# Altium project LPS_camp.PrjPcb
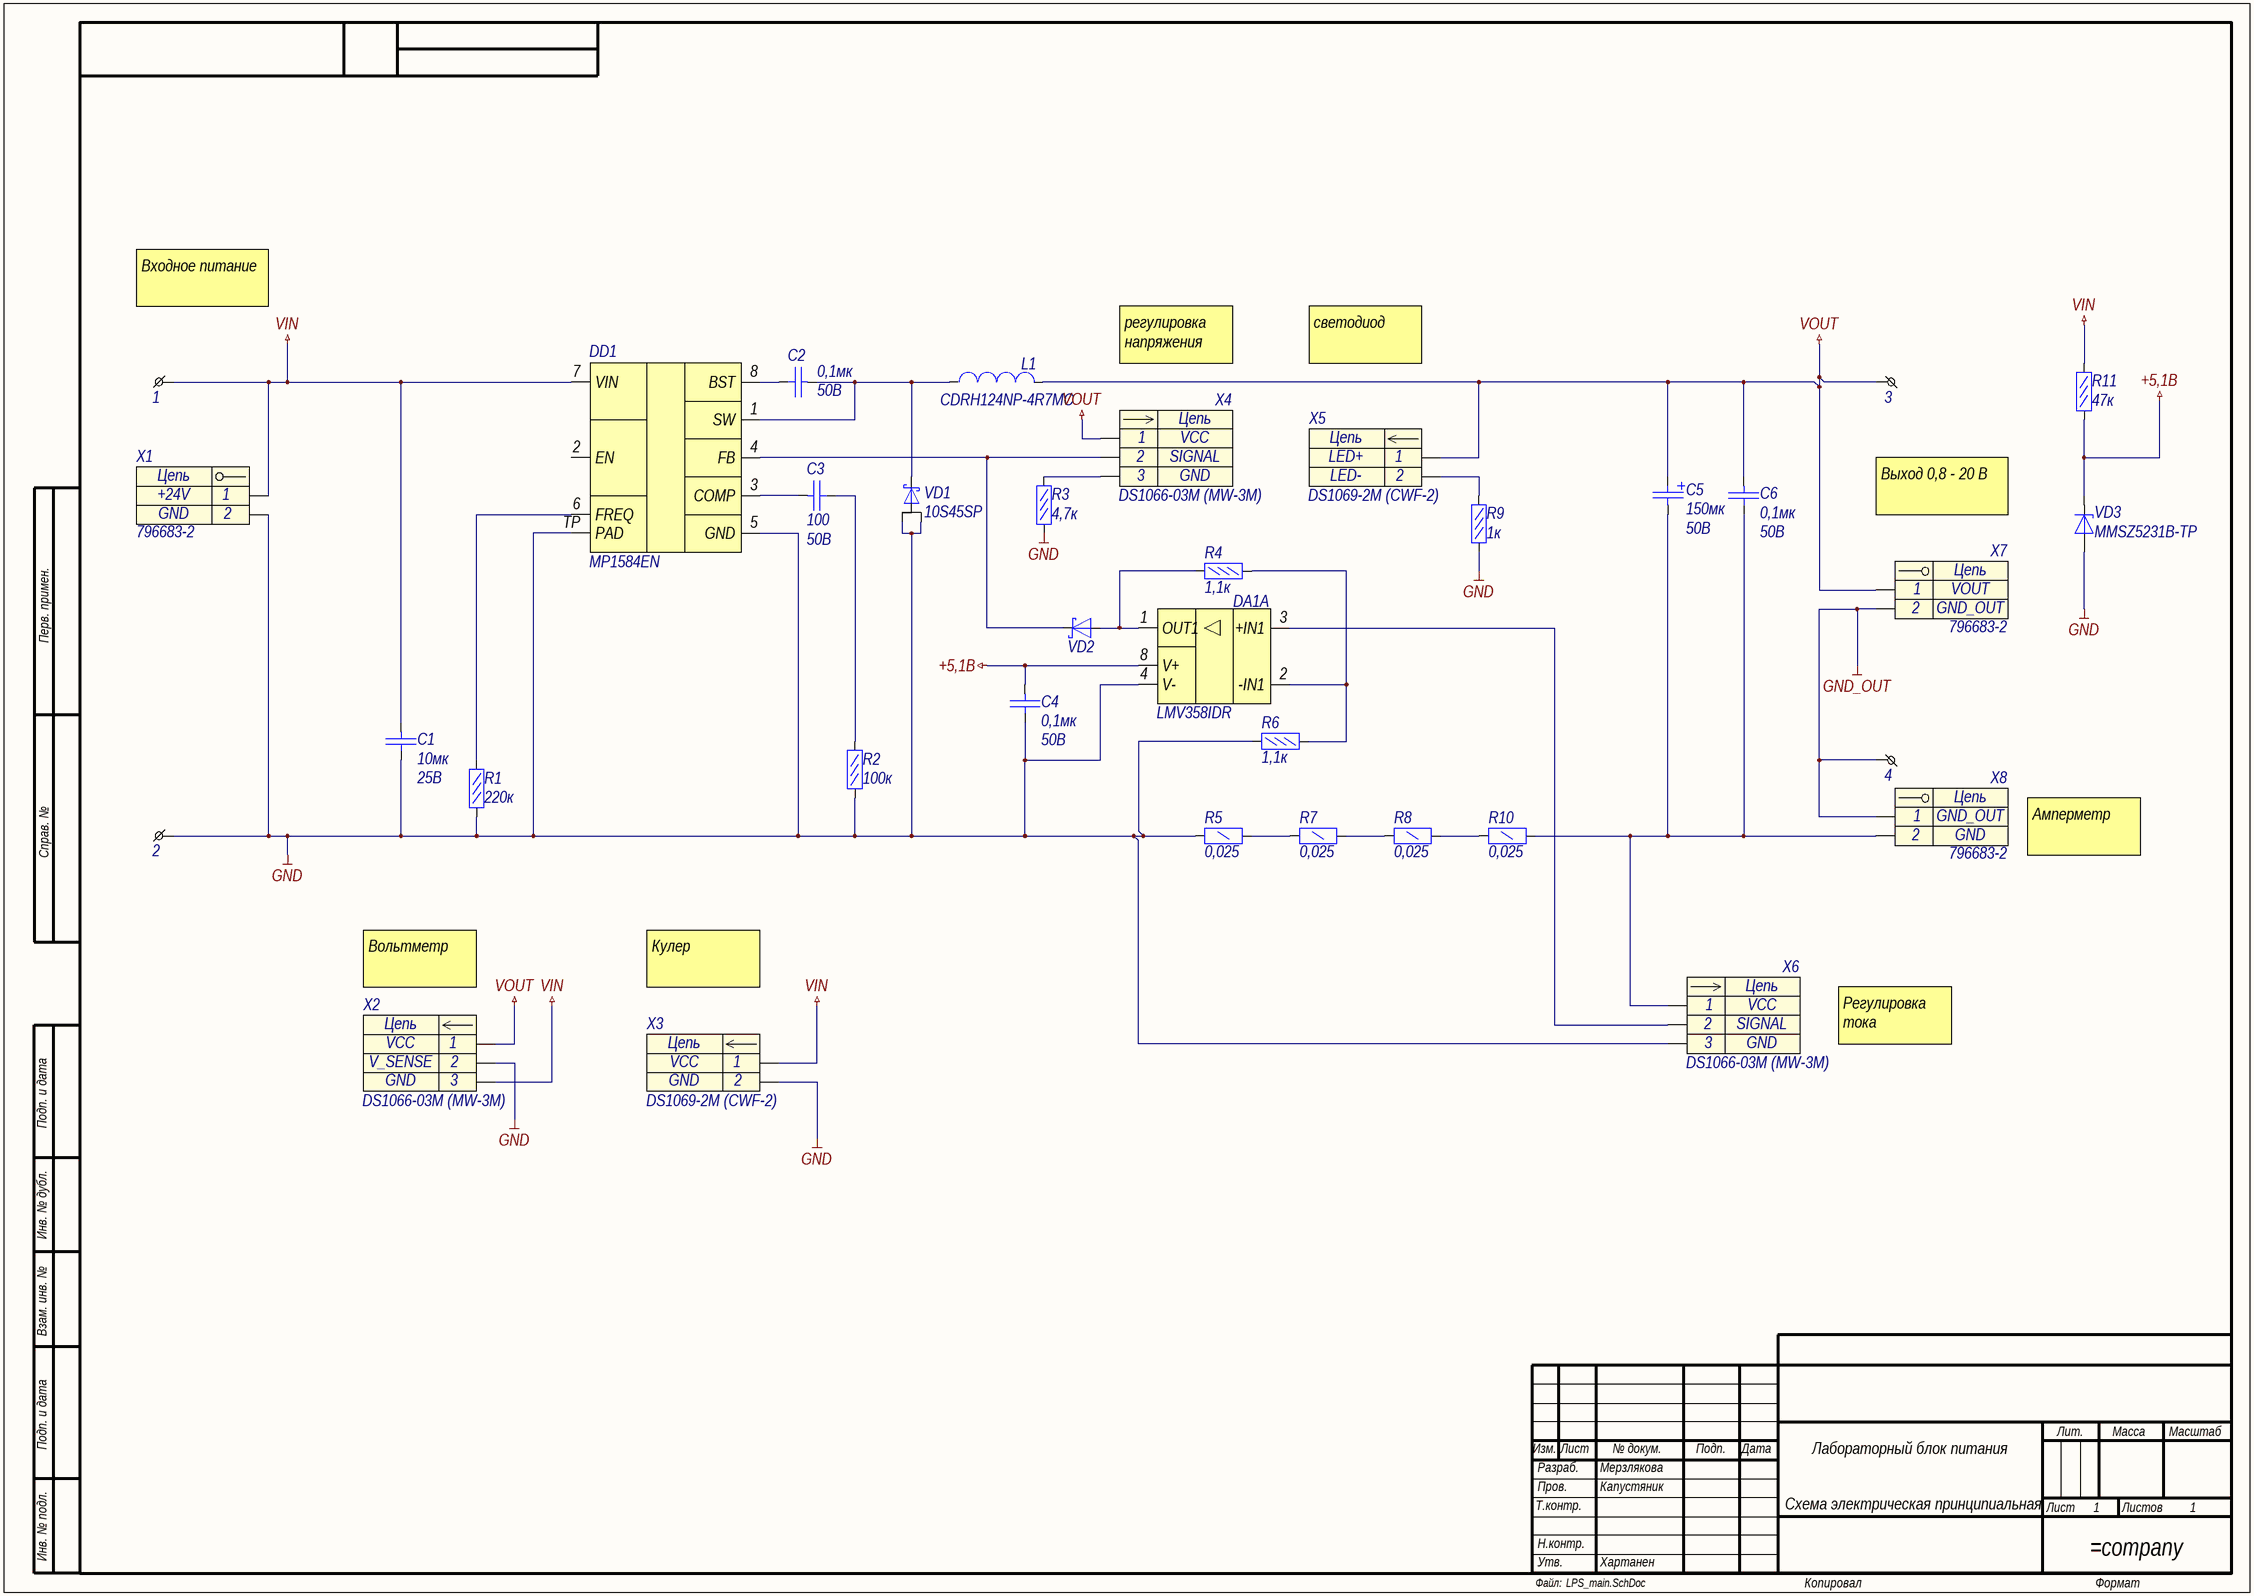
[diagram p0: LPS_main.SchDoc]
approver: Хартанен; developer: Мерзлякова; device_title: Лабораторный блок питания; document_code: Э3; document_type: Схема электрическая принципиальная; reviewer: Капустяник
1 sheet, 35 parts. Net scope: global (net labels, ports and power ports of the same name join across sheets).
Board file: LPS.PcbDoc

## Sheet LPS_main.SchDoc
size 594 x 420 mm; SheetNumber: 1; SheetTotal: 1

### Parts
1  SOLDER_PAD  [PAD_5_8mm]  (value not drawn)  (no BOM)
2  SOLDER_PAD  [PAD_5_8mm]  (value not drawn)  (no BOM)
3  SOLDER_PAD  [PAD_5_8mm]  (value not drawn)  (no BOM)
4  SOLDER_PAD  [PAD_5_8mm]  (value not drawn)  (no BOM)
C1  Voltage: 25В  [C1206]  (hidden comment: 10мк)
C2  Voltage: 50В  [C0603]  (hidden comment: 0,1мк)
C3  Voltage: 50В  [C0603]  (hidden comment: 100)
C4  Voltage: 50В  [C0603]  (hidden comment: 0,1мк)
C5  Voltage: 50В  [CAPALUM_10x12.5]  (hidden comment: 150мк)
C6  Voltage: 50В  [C0603]  (hidden comment: 0,1мк)
DA1  LMV358IDR  [SOIC-8]  (part A of 2)
DD1  MP1584EN  [SOIC-8 with PAD]
L1  CDRH124NP-4R7MC  [CDRH124]
R1  220к  [R0603]
R2  100к  [R0603]
R3  4,7к  [R0603]
R4  1,1к  [R0603]
R5  0,025  [R1206]
R6  1,1к  [R0603]
R7  0,025  [R1206]
R8  0,025  [R1206]
R9  1к  [R0603]
R10  0,025  [R1206]
R11  47к  [R0603]
VD1  10S45SP  [TO-277A]
VD2  1N5817WS  [SOD323]  (value not drawn)
VD3  MMSZ5231B-TP  [SOD123]
X1  796683-2  [796683-2]
X2  DS1066-03M (MW-3M)  [MW-3M]
X3  DS1069-2M (CWF-2)  [CWF-2]
X4  DS1066-03M (MW-3M)  [MW-3M]
X5  DS1069-2M (CWF-2)  [CWF-2]
X6  DS1066-03M (MW-3M)  [MW-3M]
X7  796683-2  [796683-2]
X8  796683-2  [796683-2]

### Nets
+5,1В: C4.2 DA1.8(V+) R11.2 VD3.1(K)
GND: 2.1 C1.1 C4.1 DA1.4(V-) DD1.5(GND) DD1.TP(PAD) R1.1 R2.2 R3.1 R5.1 R6.2 R9.1 VD1.1(A) VD1.2(A) VD3.2(A) X1.2 X2.2 X3.2 X6.3
GND_OUT: 4.1 X7.2 X8.1
VIN: 1.1 C1.2 DD1.7(VIN) R11.1 X1.1 X2.3 X3.1
VOUT: 3.1 C5.1 C6.2 L1.2 X2.1 X4.1 X5.1 X7.1
NetC2_1: C2.1 DD1.8(BST)
NetC2_2: C2.2 DD1.1(SW) L1.1 VD1.3(K)
NetC3_1: C3.1 R2.1
NetC3_2: C3.2 DD1.3(COMP)
NetC5_2: C5.2 C6.1 R10.2 X6.1 X8.2
NetDA1_1: DA1.1(OUT1) R4.1 VD2.2(A)
NetDA1_2: DA1.2(-IN1) R4.2 R6.1
NetDA1_3: DA1.3(+IN1) X6.2
NetDD1_4: DD1.4(FB) VD2.1(K) X4.2
NetDD1_6: DD1.6(FREQ) R1.2
NetR3_2: R3.2 X4.3
NetR5_2: R5.2 R7.1
NetR7_2: R7.2 R8.1
NetR8_2: R8.2 R10.1
NetR9_2: R9.2 X5.2

Not connected (* = marked no-connect by the designer): DD1 2(EN)

### Notes on the sheet
- Входное питание
- регулировка напряжения
- светодиод
- Выход 0,8 - 20 В
- Амперметр
- Вольтметр
- Кулер
- Регулировка тока
- Перв. примен.
- Справ. №
- Подп. и дата
- Инв. № дубл.
- Взам. инв. №
- Изм.
- Лист
- № докум.
- Подп.
- Дата
- Лит.
- Масса
- Масштаб
- Т.контр.
- Пров.
- Разраб.
- Листов
- Инв. № подл.
- Н.контр.
- Файл:
- Утв.
- Копировал
- Формат
- (in symbol 796683-2) Цепь
- (in symbol CWF-2) Цепь
- (in symbol MW-3M) Цепь

### Library data of the parts
C1 = CC1206KKX7R8BB106: Конденсатор кер. 10мкФ 25В; Manufacturer: Yageo; TKE: X7R; Name: CC1206KKX7R8BB106; Value: 10мк
C2 C4 C6 = CC0603JPX7R9BB104: Конденсатор кер. 0,1мкФ 50В; Manufacturer: Yageo; TKE: X7R; Name: CC0603JPX7R9BB104; Value: 0,1мк
C3 = CC0603JRNPO9BN101: Конденсатор кер. 100пФ 50В; Manufacturer: Yageo; TKE: NP0; Name: CC0603JRNPO9BN101; Value: 100
C5 = B41858C6157M: Конденсатор эл.лит. алюм. 150мкФ 50В; Manufacturer: EPCOS; ESR: 0,3Ом; Name: B41858C6157M; Value: 150мк
DA1 = LMV358IDR: Сдвоенный операционнй усилитель 2.7-5В CMOS Rail-to-rail; Manufacturer: TI; Name: LMV358IDR
DD1 = MP1584EN: регулируемый стабилизатор напряжения; Name: MP1584EN
L1 = CDRH124NP-4R7MC: Катушка с сердечником 4,7мкГн 0,8А; Value: 4,7мк; I saturation: 5,7А; R: 0,014; Name: CDRH124NP-4R7MC
R1 = RC0603FR-07220KL: Резистор 220кОм 0,1Вт 1%; Manufacturer: YAGEO; Name: RC0603FR-07220KL; Tolerance: 1%; Value: 220к
R2 = RC0603FR-07100KL: Резистор 100кОм 0,1Вт 1%; Manufacturer: YAGEO; Name: RC0603FR-07100KL; Tolerance: 1%; Value: 100к
R3 = RC0603FR-074K7L: Резистор 4,7кОм 0,063Вт 1%; Manufacturer: YAGEO; Name: RC0603FR-074K7L; Tolerance: 1%; Value: 4,7к
R4 R6 = RC0603FR-071K1L: Резистор 1,1кОм 0,063Вт 1%; Manufacturer: YAGEO; Name: RC0603FR-071K1L; Tolerance: 1%; Value: 1,1к
R5 R7 R8 R10 = RC1206FR-07180KL: Резистор 180к 0,25Вт 1%; Manufacturer: YAGEO; Name: RC1206FR-07180KL; Value: 0,025
R9 = RC0603FR-071KL: Резистор 1кОм 0,063Вт 1%; Manufacturer: YAGEO; Name: RC0603FR-071KL; Tolerance: 1%; Value: 1к
R11 = RC0603FR-0747KL: Резистор 47кОм 0,063Вт 1%; Manufacturer: YAGEO; Name: RC0603FR-0747KL; Tolerance: 1%; Value: 47к
VD1 = 10S45SP: Диод Шоттки 45В 10А; Manufacturer: YFW; Name: 10S45SP
VD2 = 1N5817WS: Диод Шоттки 1N5817WS 20V 1А 0.45V; Производитель: Hottech Co. Ltd; current: 1A; voltage: 20В; drop voltage: 0,45В; Name: 1N5817WS
VD3 = MMSZ5231B-TP: Стабилитрон 5,1В; Name: MMSZ5231B-TP
X1 = 796683-2: Винтовой клеммник (наборный 2х2); Contact_1: +24V; Contact_2: GND; Name: 796683-2
X2 = MW-3M: Разъем - 3 конт. прямая вилка на плату; Contact_1: VCC; Contact_2: V_SENSE; Contact_3: GND; Name: DS1066-03M (MW-3M)
X3 = CWF-2: Разъем - 2 конт. прямая вилка на плату; Contact_1: VCC; Contact_2: GND; Name: DS1069-2M (CWF-2)
X4 X6 = MW-3M: Разъем - 3 конт. прямая вилка на плату; Contact_1: VCC; Contact_2: SIGNAL; Contact_3: GND; Name: DS1066-03M (MW-3M)
X5 = CWF-2: Разъем - 2 конт. прямая вилка на плату; Contact_1: LED+; Contact_2: LED-; Name: DS1069-2M (CWF-2)
X7 = 796683-2: Винтовой клеммник (наборный 2х2); Contact_1: VOUT; Contact_2: GND_OUT; Name: 796683-2
X8 = 796683-2: Винтовой клеммник (наборный 2х2); Contact_1: GND_OUT; Contact_2: GND; Name: 796683-2